# Altium project KE_PDB_BMS.PrjPcb
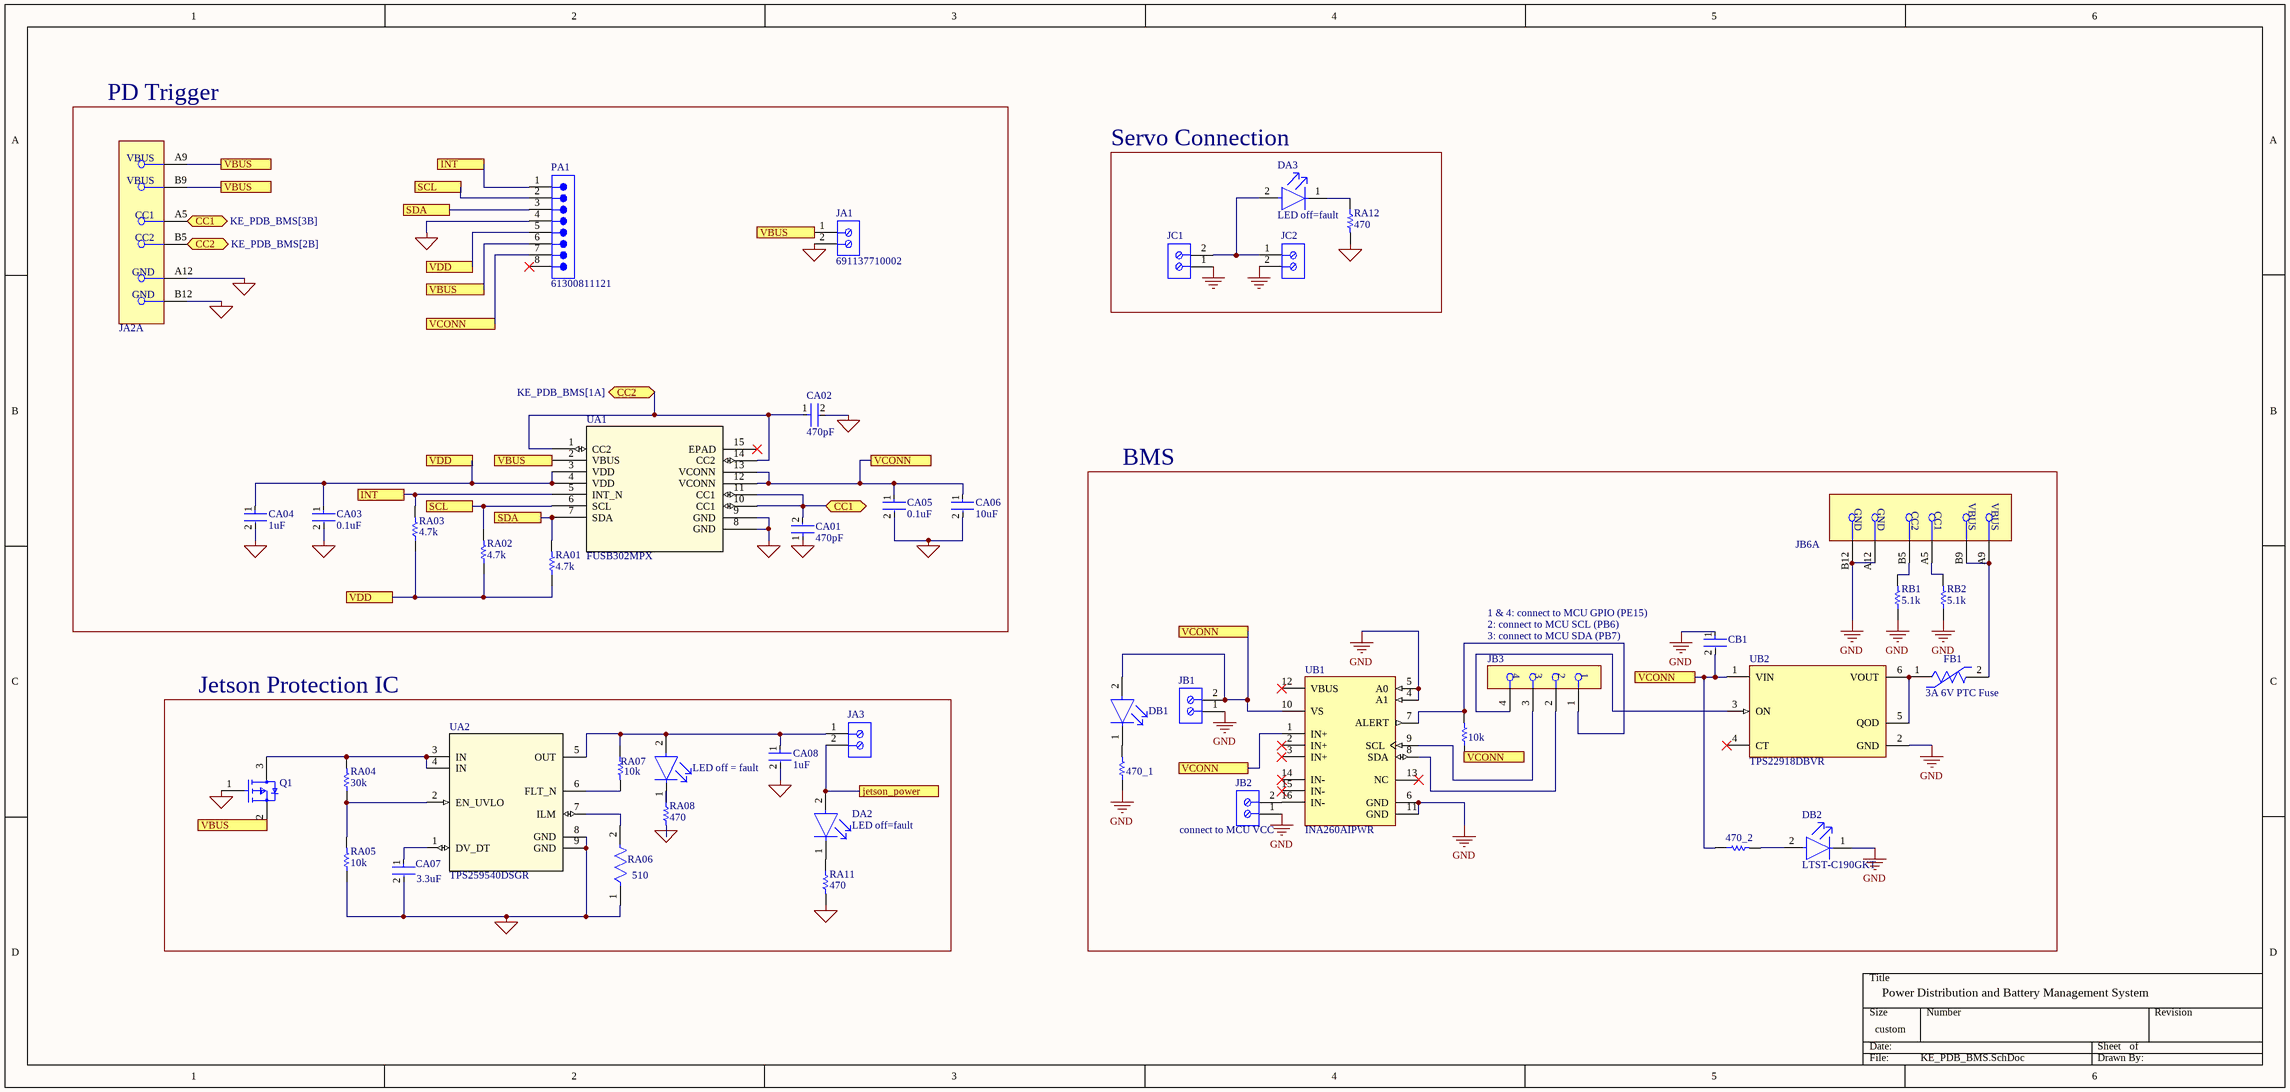
[diagram p0: KE_PDB_BMS.SchDoc]
1 sheet, 45 parts. Net scope: flat (ports and power ports of the same name join across sheets).
Board files: KE_PDB_BMS_ver1.PcbDoc, KE_PDB_BMS_ver2.PcbDoc, KE_PDB_BMS_ver3.PcbDoc

## Sheet KE_PDB_BMS.SchDoc
size 508 x 241 mm; SheetNumber: 1; SheetTotal: 1

### Parts
10k  10k  [RESC1608X55X25ML10T15]  (value not drawn)
470_1  RC0402JR-07470RL  [RESC1005X40X25LL05T10]  (value not drawn)
470_2  RC0402JR-07470RL  [RESC1005X40X25LL05T10]  (value not drawn)
CA01  470pF  [FP-C3216-085-0_2-IPC_C]
CA02  470pF  [FP-C3216-085-0_2-IPC_C]
CA03  0.1uF  [FP-CL93-IPC_C]
CA04  1uF  [FP-CL10-IPC_C]
CA05  0.1uF  [FP-CL93-IPC_C]
CA06  10uF  [FP-CL05A106MP5NUNC-MFG]
CA07  3.3uF  [FP-GRM188-0_1-e0_2_0_5-IPC_A]
CA08  1uF  [FP-CL10-IPC_C]
CB1  C3225X5R1E106M250AA  [FP-C3225-250-0_4-MFG]  (value not drawn)
DA1  LED off = fault  [FP-LTST-C190GKT-MFG]
DA2  LED off=fault  [FP-LTST-C190GKT-MFG]
DA3  LED off=fault  [FP-LTST-C190GKT-MFG]
DB1  LTST-C190GKT  [FP-LTST-C190GKT-MFG]  (value not drawn)
DB2  LTST-C190GKT  [FP-LTST-C190GKT-MFG]
FB1  3A 6V PTC Fuse  [FP-PTSLR06036V300-MFG]
JA1  691137710002  [691137710002]
JA2  217175-0001  [FP-217175-0001-MFG]  (value not drawn)  (part A of 2)
JA3  691137710002  [691137710002]  (value not drawn)
JB1  691137710002  [691137710002]  (value not drawn)
JB2  691137710002  [691137710002]  (value not drawn)
JB3  LPPB041NFFN-RC  [FP-LPPB041NFFN-RC-MFG]  (value not drawn)
JB6  217175-0001  [FP-217175-0001-MFG]  (value not drawn)  (part A of 2)
JC1  691137710002  [691137710002]  (value not drawn)
JC2  691137710002  [691137710002]  (value not drawn)
PA1  61300811121  [61300811121]
Q1  IRLML6402TRPBF  [FP-Micro3-MFG]  (value not drawn)
RA01  4.7k  [RESC1608X55X25LL10T15]
RA02  4.7k  [RESC1608X55X25LL10T15]
RA03  4.7k  [RESC1608X55X25LL10T15]
RA04  30k  [RESC1005X40X25ML10T10]
RA05  10k  [RESC1608X55X25ML10T15]
RA06  510  [FP-RMCF0805-MFG]
RA07  10k  [RESC1608X55X25ML10T15]
RA08  470  [RESC1005X40X25LL05T10]
RA11  470  [RESC1005X40X25LL05T10]
RA12  470  [RESC1005X40X25LL05T10]
RB1  5.1k  [RESC1608X55X25ML10T15]
RB2  5.1k  [RESC1608X55X25ML10T15]
UA1  FUSB302MPX  [MLP14_2P5X2P5_ONS]
UA2  TPS259540DSGR  [DSG0008A]
UB1  INA260AIPWR  [FP-PW0016A-MFG]
UB2  TPS22918DBVR  [FP-DBV0006A-MFG]

### Blocks framed on the sheet
PD Trigger: CA01 CA02 CA03 CA04 CA05 CA06 JA1 JA2 PA1 RA01 RA02 RA03 UA1
Servo Connection: DA3 JC1 JC2 RA12
BMS: 10k 470_1 470_2 CB1 DB1 DB2 FB1 JB1-JB3 JB6 RB1 RB2 UB1 UB2
Jetson Protection IC: CA07 CA08 DA1 DA2 JA3 Q1 RA04 RA05 RA06 RA07 RA08 RA11 UA2

### Ports
CC1 (bidir, see KE_PDB_BMS[1A]), CC1 (bidir, see KE_PDB_BMS[3B]), CC2 (bidir, see KE_PDB_BMS[1A]), CC2 (bidir, see KE_PDB_BMS[2B]), INT (see KE_PDB_BMS[1B]), INT (see KE_PDB_BMS[2A]), jetson_power, SCL (see KE_PDB_BMS[2A]), SCL (see KE_PDB_BMS[2B]), SDA (see KE_PDB_BMS[2A]), SDA (see KE_PDB_BMS[2B]), VBUS (see KE_PDB_BMS[1A], KE_PDB_BMS[1D], KE_PDB_BMS[2A], KE_PDB_BMS[2B]), VBUS (see KE_PDB_BMS[1A], KE_PDB_BMS[1D], KE_PDB_BMS[2B]), VBUS (see KE_PDB_BMS[1A], KE_PDB_BMS[2A], KE_PDB_BMS[2B]), VCONN (see KE_PDB_BMS[2B], KE_PDB_BMS[3B], KE_PDB_BMS[4C]), VCONN (see KE_PDB_BMS[2B], KE_PDB_BMS[3B], KE_PDB_BMS[4C], KE_PDB_BMS[5C]), VCONN (see KE_PDB_BMS[2B], KE_PDB_BMS[4C], KE_PDB_BMS[5C]), VCONN (see KE_PDB_BMS[3B], KE_PDB_BMS[4C], KE_PDB_BMS[5C]), VDD (see KE_PDB_BMS[1C], KE_PDB_BMS[2A]), VDD (see KE_PDB_BMS[1C], KE_PDB_BMS[2B]), VDD (see KE_PDB_BMS[2A], KE_PDB_BMS[2B])

### Nets
GND: 470_1.1 CA01.1 CA02.2 CA03.2 CA04.2 CA05.2 CA06.2 CA07.2 CA08.2 CB1.1 DB2.1(C) JA1.2 JA2.A12(GND) JA2.B12(GND) JB1.1 JB2.1 JB6.A12(GND) JB6.B12(GND) JC1.1 JC2.2 PA1.4 Q1.1(G) RA05.1 RA06.1 RA08.2 RA11.2 RA12.2 RB1.1 RB2.1 UA1.8(GND) UA1.9(GND) UA2.8(GND) UA2.9(GND) UB1.4(A1) UB1.5(A0) UB1.6(GND) UB1.11(GND) UB2.2(GND)
Net10k_1: 10k.1 470_2.1 CA05.1 CA06.1 CB1.2 DB1.2(A) JB1.2 PA1.7 UA1.12(VCONN) UA1.13(VCONN) UB1.1(IN+) UB1.10(VS) UB2.1(VIN) ; port VCONN
Net10k_2: 10k.2 JB3.1 UB1.7(ALERT)
Net470_1_2: 470_1.2 DB1.1(C)
Net470_2_2: 470_2.2 DB2.2(A)
NetCA01_2: CA01.2 JA2.A5(CC1) UA1.10(CC1) UA1.11(CC1) ; port CC1
NetCA02_1: CA02.1 JA2.B5(CC2) UA1.1(CC2) UA1.14(CC2) ; port CC2
NetCA03_1: CA03.1 CA04.1 PA1.5 RA01.1 RA02.1 RA03.1 UA1.3(VDD) UA1.4(VDD) ; port VDD
NetCA07_1: CA07.1 UA2.1(DV_DT)
NetCA08_1: CA08.1 DA1.2(A) JA3.1 RA07.1 UA2.5(OUT)
NetDA1_1: DA1.1(C) RA08.1
NetDA2_1: DA2.1(C) RA11.1
NetDA2_2: DA2.2(A) JA3.2 ; port jetson_power
NetDA3_1: DA3.1(C) RA12.1
NetDA3_2: DA3.2(A) JC1.2 JC2.1
NetFB1_1: FB1.1 UB2.5(QOD) UB2.6(VOUT)
NetFB1_2: FB1.2 JB6.A9(VBUS) JB6.B9(VBUS)
NetJA1_1: JA1.1 JA2.A9(VBUS) JA2.B9(VBUS) PA1.6 Q1.2(S) UA1.2(VBUS) ; port VBUS
NetJB2_2: JB2.2 UB1.16(IN-)
NetJB3_2: JB3.2 UB1.8(SDA)
NetJB3_3: JB3.3 UB1.9(SCL)
NetJB3_4: JB3.4 UB2.3(ON)
NetJB6_A5: JB6.A5(CC1) RB2.2
NetJB6_B5: JB6.B5(CC2) RB1.2
NetPA1_1: PA1.1 RA03.2 UA1.5(INT_N) ; port INT
NetPA1_2: PA1.2 RA02.2 UA1.6(SCL) ; port SCL
NetPA1_3: PA1.3 RA01.2 UA1.7(SDA) ; port SDA
NetQ1_3: Q1.3(D) RA04.2 UA2.3(IN) UA2.4(IN)
NetRA04_1: RA04.1 RA05.2 UA2.2(EN_UVLO)
NetRA06_2: RA06.2 UA2.7(ILM)
NetRA07_2: RA07.2 UA2.6(FLT_N)

Not connected (* = marked no-connect by the designer): PA1 8*; UA1 15(EPAD)*; UB1 2(IN+)* 3(IN+)* 12(VBUS)* 13(NC)* 14(IN-)* 15(IN-)*; UB2 4(CT)*

### Notes on the sheet
- 2: connect to MCU SCL (PB6)
- 3: connect to MCU SDA (PB7)
- 1 & 4: connect to MCU GPIO (PE15)
- (near JB2) connect to MCU VCC
- Power Distribution and Battery Management System

### Library data of the parts
10k RA05 = CMP-2000-05022-1: Resistor, 10 KOhm, +/- 5%, 100 mW, -55 to 155 degC, 0603 (1608 Metric), RoHS, Tape and Reel; Manufacturer: Yageo; Resistance: 10kOhms; Voltage Rating: 50V; Temperature Coefficient: 100PPM/C; Power Rating: 100mW; Package Reference: 603; Series: RC; Case Code - mm: 1608; Packaging: Reel; Datasheet URL: http://www.farnell.com/datasheets/443971.pdf; Datasheet Version: Rev. 4, 04/2009; Operating Temperature Range: -55Cto+155C; Product: ThickFilmResistorsGeneralPurpose; Package Description: 2-Pin Surface Mount Device, Body 1.6 x 0.8 mm; Manufacturer URL: http://www.yageo.com/; Case Code - in: 0603; Tolerance: 5%; Termination Style: SMD/SMT
470_1 470_2 = CMP-1011-00066-2: Manufacturer: Yageo / Phycomp; Part Number: RC0402JR-07470RL
CA01 CA02 = CMP-08246-003272-1: Multilayer Ceramic Capacitors 470pF ±5% 630V C0G SMD 1206; Max Operating Temperature: 125°C; Voltage Rating (DC): 630V; Capacitance: 470pF; Lead Free: Lead Free; Depth: 1.6mm; Series: C; RoHS Compliant: Yes; Radiation Hardening: No; Width: 0.063inch; Weight: 0.000571oz; Case Code (Metric): 3216; Mount: Surface Mount; Length: 3.2mm; Dielectric: C0G; Case/Package: 1206; Thickness: 0.039inch; Height: 0.85mm; Packaging: Tape and Reel; Number of Pins: 2; Case Code (Imperial): 1206; Termination: SMD/SMT; Package Quantity: 1; Min Operating Temperature: -55°C; Voltage Rating: 630V; Tolerance: 5%; Value: 470pF
CA03 CA05 = CMP-13271-000610-1: Cap Ceramic 100nF 10V X7R ±10% SMD 0402 +125°C Paper T/R
CA04 CA08 = CMP-2000-06094-2: Cap Ceramic 1uF 10V X7R ±10% Pad SMD 0603 +125°C T/R; Packaging: Tape and Reel; Depth: 0.8mm; Voltage Rating: 10V; Lead Free: Lead Free; Radiation Hardening: No; Capacitance: 1uF; Length: 1.6mm; Package Quantity: 1; Mount: Surface Mount; Case/Package: 0603; Max Operating Temperature: 125°C; Case Code (Metric): 1608; Height: 0.8mm; Min Operating Temperature: -55°C; Dielectric: X7R; Contact Plating: Tin; Case Code (Imperial): 0603; Thickness: 0.035inch; Voltage Rating (DC): 10V; Tolerance: 10%; Width: 0.031inch; Value: 1uF
CA06 = CMP-13271-000002-1: CAP CER 10UF 10V X5R 0402; Manufacturer Part Number: CL05A106MP5NUNC; Manufacturer: Samsung; Temperature Coefficient: 15%; Tolerance: 20%; Octopart: https://octopart.com/cl05a106mp5nunc-samsung-22457395; Voltage Rating: 10V; RoHS: TRUE; Value: 10uF; Height: 0.7mm; Digikey Description: CAP CER 10UF 10V X5R 0402; Automotive: No; Package: CL05A106MP5NUNC; Device Class L1: Passive Components; Capacitance: 10uF; Temperature Range High: +85°C; ComponentLink2Description: Datasheet; Device Class L2: Capacitors; Temperature Characteristic: X5R; Temperature: -55°C to +85°C; Material: Ceramic; ComponentLink2URL: http://www.samsungsem.com/kr/support/product-search/mlcc/__icsFiles/afieldfile/2019/05/10/19-CL05A106MP5NUNC.pdf; Device Class L3: Ceramic Capacitors; Category: Cap; Temperature Range Low: -55°C; Ipc Land Pattern Name: CAPC10050X50; Lead Free: Yes
CA07 = CMP-2006-02467-2: Chip Multilayer Ceramic Capacitors for General Purpose, 0603, 3300pF, C0G, 30ppm/°C, 5%, 50V; Capacitance: 3.3nF; Value: 3.3nF; Max Operating Temperature: 125°C; Voltage Rating (DC): 50V; Termination: SMD/SMT; Packaging: Tape and Reel; Tolerance: 5%; Lead Free: Lead Free; Width: 0.031inch; Thickness: 0.035inch; REACH SVHC: No SVHC; Dielectric: C0G; Min Operating Temperature: -55°C; Material: Ceramic; Voltage Rating: 50V; Case/Package: 0603; Length: 1.6mm; Voltage: 50V; Case Code (Imperial): 0603; Radiation Hardening: No; Case Code (Metric): 1608; Mount: Surface Mount; Height: 0.8mm; Package Quantity: 4000; Depth: 0.8mm
CB1 = CMP-08246-006012-1: Multilayer Ceramic Capacitors 10uF ±20% 25V X5R SMD 1210; RoHS Compliant: Yes; Max Operating Temperature: 85°C; Voltage Rating: 25V; Height: 2.5mm; Capacitance: 10uF; Dielectric: X5R; Min Operating Temperature: -55°C; Mount: Surface Mount; Package Quantity: 1; Case/Package: 1210; Thickness: 0.11inch; Resistor Type: Ceramic; Series: C; Voltage: 25V; Number of Pins: 2; Lead Free: Lead Free; Depth: 2.5mm; Construction: Flat; Packaging: Tape and Reel; Tolerance: 20%; Weight: 0.000564oz; Dielectric Material: Ceramic; Voltage Rating (DC): 25V; Radiation Hardening: No; Case Code (Imperial): 1210; Width: 0.098inch; REACH SVHC: No SVHC; Length: 3.2mm; Termination: SMD/SMT; Case Code (Metric): 3225
DA1-DA3 DB1 DB2 = CMP-22017-000005-2: LED GREEN CLEAR CHIP SMD; Dominant Wavelength: 569nm; Reverse Voltage: 5V; Lens Color: Colorless; Viewing Angle: 130°; Voltage: 2V; Forward Current: 30mA; Power Dissipation: 100mW; Luminous Intensity: 6mcd; Number of LEDs: 1; Forward Voltage: 2.1V; Wavelength: 565nm; Test Current: 10mA; Min Operating Temperature: -55°C; Lens Style: Clear; Mount: Surface Mount; Width: 0.8mm; Packaging: Tape and Reel; Lens Transparency: Clear; Case Code (Metric): 1608; Depth: 0.8mm; Case Code (Imperial): 0603; Case/Package: 0603; Number of Pins: 2; Max Operating Temperature: 85°C; Lead Free: Lead Free; Number of Elements: 1; Length: 1.6mm; Height: 0.8mm; Package Quantity: 1; Power Rating: 100mW; Radiation Hardening: No; Illumination Color: Green; Color: Green
FB1 = CMP-16244-000012-1: PTC RESET FUSE 3A 6V 0603
JA1 JA3 JB1 JB2 JC1 JC2 = CMP-1502-03324-2: NexarPartId: 78871135; Voltage Rating: 300V; Number of Contacts: 2; Current Rating: 16A; Lead Pitch: 5mm; Height: 11.6mm; Packaging: Box; RoHS: Non-Compliant; Contact Material: Nickel, Tin; Max Operating Temperature: 120°C; Number of Pins: 2; Min Operating Temperature: -30°C; Number of Rows: 1
JA2 JB6 = CMP-04767-000026-1: CONN RCP USB2.0 C 6+18P SMD RA
JB3 = CMP-25680-000035-1: CONN HDR 4POS 0.05 GOLD PCB; Pitch: 0.05inch; Number of Positions: 4; Connector Type: Header; Contact Type: Female Socket; Lead Free: Lead Free; Mount: Through Hole; RoHS Compliant: Yes; Package Quantity: 1; Termination: Solder; Contact Plating: Gold; Number of Rows: 1; Packaging: Bulk
PA1 = CMP-1502-01076-3: NexarPartId: 32855533; Connector Type: Male Pin; Number of Contacts: 8; Voltage Rating: 250V; Current Rating: 3A; Contact Resistance: 20mΩ; Pitch: 2.54mm; Gender: Male; Termination: Solder; Contact Material: Copper; Mount: Through Hole; Lead Pitch: 2.54mm; Number of Positions: 8; Operating Supply Voltage: 250V; Number of Pins: 8; Max Operating Temperature: 105°C; Height: 8.54mm; REACH SVHC: Unknown; Number of Rows: 1; Packaging: Bulk; Contact Plating: Gold; Contact Mating Length: 5.9944mm; Orientation: Vertical; RoHS: Compliant; Color: Black; Min Operating Temperature: -40°C
Q1 = CMP-32901-000130-1: MOSFET P-CH 20V 3.7A SOT-23; Manufacturer: Infineon; Reverse Recovery Time: 29ns; Max Forward Diode Voltage: -1.2V; Input Capacitace At Vds: 633pF @ -10V; Drain To Source Resistance: 0.05Ω; Gate To Source Voltage: 12V; Max Junction Temp: +150°C; Pulse Drain Current: -22A; Threshold Vgs Min: -0.4V; Turn Off Delay Time: 588ns; Number Of Channels: 1; Power Dissipation: 1.3W; Turn On Delay Time: 350ns; Drain To Source Breakdown Voltage: -20V; Continuous Drain Current: -3.7A; Depletion Mode: False; Gate Charge At Vgs: 8nC @ -5V; Rthja Max: 75°C/W; Threshold Vgs: -0.55V; Standoff Height: 0.01mm; Reverse Recovery Charge: 11nC; Device Class L2: Transistors; Ipc Land Pattern Name: SOT95P237X100-3; Temperature Range High: +150°C; Octopart: https://octopart.com/irlml6402trpbf-infineon-65874989; ComponentLink2URL: https://www.infineon.com/dgdl/irlml6402pbf.pdf?fileId=5546d462533600a401535668d5c2263c; Automotive: No; Manufacturer Part Number: IRLML6402TRPBF; Height: 1.12mm; Drain To Source Voltage: -20V; Digikey Description: MOSFET P-CH 20V 3.7A SOT-23; Device Class L1: Discrete Semiconductors; Package: Micro3; Lead Free: Yes; Temperature Range Low: -55°C; Number Of P Channels: 1; Technology: MOSFET; Temperature: -55°C to +150°C; Category: Trans; Footprint Url: http://irf.com/package/outline/po_micro3.pdf; RoHS: TRUE; Device Class L3: MOSFETs; Threshold Vgs Max: -1.2V; ComponentLink2Description: Datasheet
RA01 RA02 RA03 = CMP-2000-06942-1: Chip Resistor, 4.7 KOhm, +/- 1%, 0.1 W, -55 to 155 degC, 0603 (1608 Metric), RoHS, Tape and Reel; Manufacturer: Yageo; Power Rating: 100mW; Temperature Coefficient: 100PPM/C; Resistance: 4.7kOhms; Voltage Rating: 50V; Value: 4.7kOhms; Package Reference: 0603; Series: RC; Datasheet Version: Rev. 7, 05/2017; Packaging: Reel; Termination Style: SMD/SMT; Datasheet URL: http://www.yageo.com/documents/recent/PYu-RC_Group_51_RoHS_L_7.pdf; Manufacturer URL: http://www.yageo.com/; Package Description: 2-Pin Surface Mount Device, Body 1.6 x 0.8 mm; Case Code - mm: 1608; Case Code - in: 0603; Mounting Technology: SurfaceMount; Operating Temperature Range: -55Cto+155C; Tolerance: 1%; Product: ThickFilmResistorsGeneralPurpose
RA04 = CMP-2002-05800-1: Manufacturer: Panasonic; Part Number: ERA-2AEB303X
RA06 = CMP-26527-004489-1: 510Ω ±5% 0.125W 0805 Thick Film Chip Resistor AEC-Q200 compliant; Max Power Dissipation: 125mW; Temperature Coefficient: 200ppm/°C; Resistance: 510R; Value: 510R; Construction: Rectangular; Packaging: Tape and Reel; Case Code (Imperial): 0805; Features: Automotive AEC-Q200; Mount: Surface Mount; Resistor Type: Thick Film; Min Operating Temperature: -55°C; Lead Free: Lead Free; Contact Plating: Tin; Width: 0.049inch; Depth: 1.25mm; Length: 0.079inch; Radiation Hardening: No; Size Code: 0805; Series: RMCF; Case Code (Metric): 2012; Number of Terminations: 2; Case/Package: 0805; RoHS Compliant: Yes; Max Operating Temperature: 155°C; Tolerance: 5%; Military Standard: Not; Height: 0.026inch; Power Rating: 125mW
RA07 = CMP-2000-05022-1: Resistor, 10 KOhm, +/- 5%, 100 mW, -55 to 155 degC, 0603 (1608 Metric), RoHS, Tape and Reel; Manufacturer: Yageo; Resistance: 10kOhms; Voltage Rating: 50V; Temperature Coefficient: 100PPM/C; Power Rating: 100mW; Value: 10kOhms; Package Reference: 603; Series: RC; Case Code - mm: 1608; Packaging: Reel; Datasheet URL: http://www.farnell.com/datasheets/443971.pdf; Datasheet Version: Rev. 4, 04/2009; Operating Temperature Range: -55Cto+155C; Product: ThickFilmResistorsGeneralPurpose; Package Description: 2-Pin Surface Mount Device, Body 1.6 x 0.8 mm; Manufacturer URL: http://www.yageo.com/; Case Code - in: 0603; Tolerance: 5%; Termination Style: SMD/SMT
RA08 RA11 RA12 = CMP-1011-00066-2: Part Number: RC0402JR-07470RL; Manufacturer: Yageo / Phycomp
RB1 RB2 = CMP-2000-04091-1: Manufacturer: Yageo; Part Number: RC0603FR-075K1L
UA1 = FUSB302MPX: No Description Available; Mfr_Name: onsemi; RefDes: RefDes; Type: Type
UA2 = TPS259540DSGR: No Description Available; Mfr_Name: Texas Instruments; TYPE: TYPE; RefDes: RefDes
UB1 = CMP-04910-000015-1: IC MONITOR PWR/CURR 16TSSOP; Manufacturer: Texas Instruments; Nominal Supply Current: 310uA; Max Junction Temp: +150°C; Standoff Height: 0.05mm; Max Supply Voltage: 5.5V; Min Supply Voltage: 2.7V; Output Current: 10mA; Ambient Temperature Range High: +125°C; ComponentLink2Description: Datasheet; Manufacturer Part Number: INA260AIPWR; Automotive: No; RoHS: TRUE; Lead Free: Yes; Package: PW0016A; Device Class L2: Power Management ICs; Temperature Range Low: -40°C; Digikey Description: IC MONITOR PWR/CURR 16TSSOP; Height: 1.2mm; Temperature: -40°C to +125°C; Device Class L1: Integrated Circuits (ICs); Device Class L3: unset; Octopart: https://octopart.com/ina260aipwr-texas+instruments-75199489; Category: IC; Ambient Temperature Range Low: -40°C; Temperature Range High: +125°C; ComponentLink2URL: http://www.ti.com/lit/ds/symlink/ina260.pdf
UB2 = CMP-04910-000024-2: IC SINGLE CHANNEL LOAD SWITCH; NexarPartId: 71360943; Manufacturer Lifecycle Status: ACTIVE; Fall Time: 2µs; Max Junction Temperature (Tj): 125°C; Number of Channels: 1; Output Current: 2A; Max Supply Voltage: 5.5V; Output Configuration: High Side; Min Supply Voltage: 1V; Interface: On/Off; Rise Time: 2.54ms; Turn-On Delay Time: 1.95ms; Lead Free: Lead Free; RoHS: Compliant; Ambient Temperature Range High: 105°C; Thickness: 1.2mm; Width: 1.6mm; Lifecycle Status: Production; Case/Package: SOT-23; Schedule B: 8542390000, 8542390000; Turn-Off Delay Time: 2µs; Max Output Current: 2A; Number of Outputs: 1; Number of Pins: 6; Height: 1.45mm; Number of Drivers: 1; Length: 2.9mm; Max Operating Temperature: 105°C; Min Operating Temperature: -40°C